# EAGLE board FranKinksTides-v1.4 (EAGLE 7.2.0), part 1 of 2
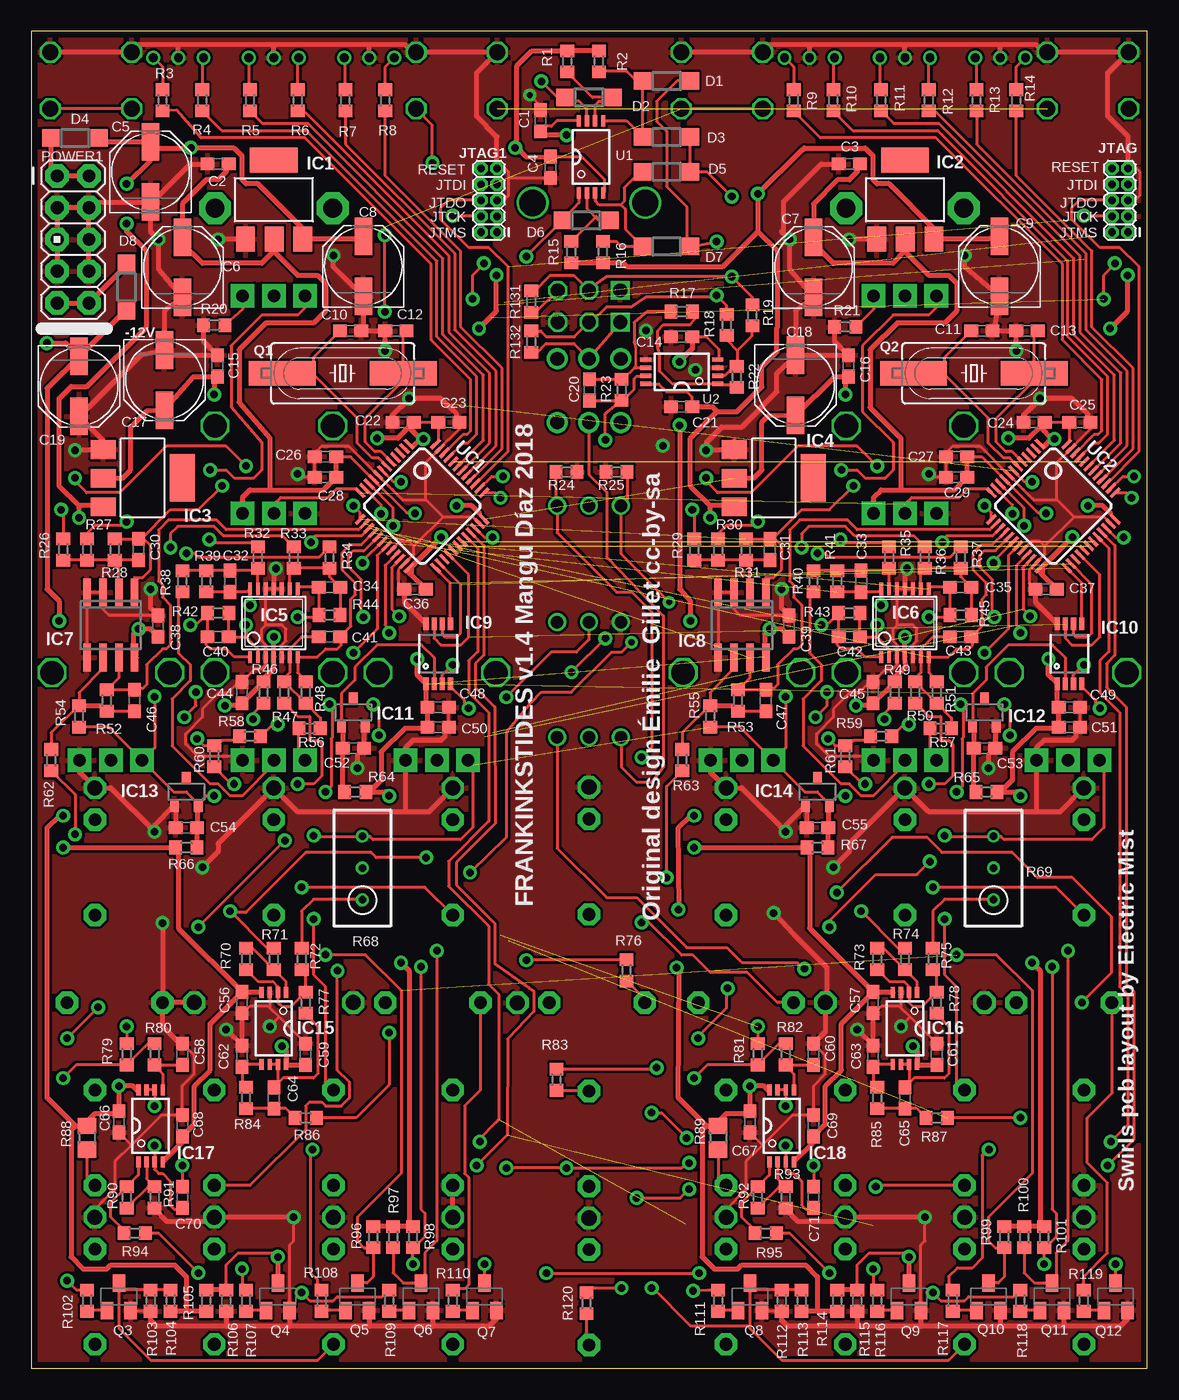
[diagram p7: board, top side]
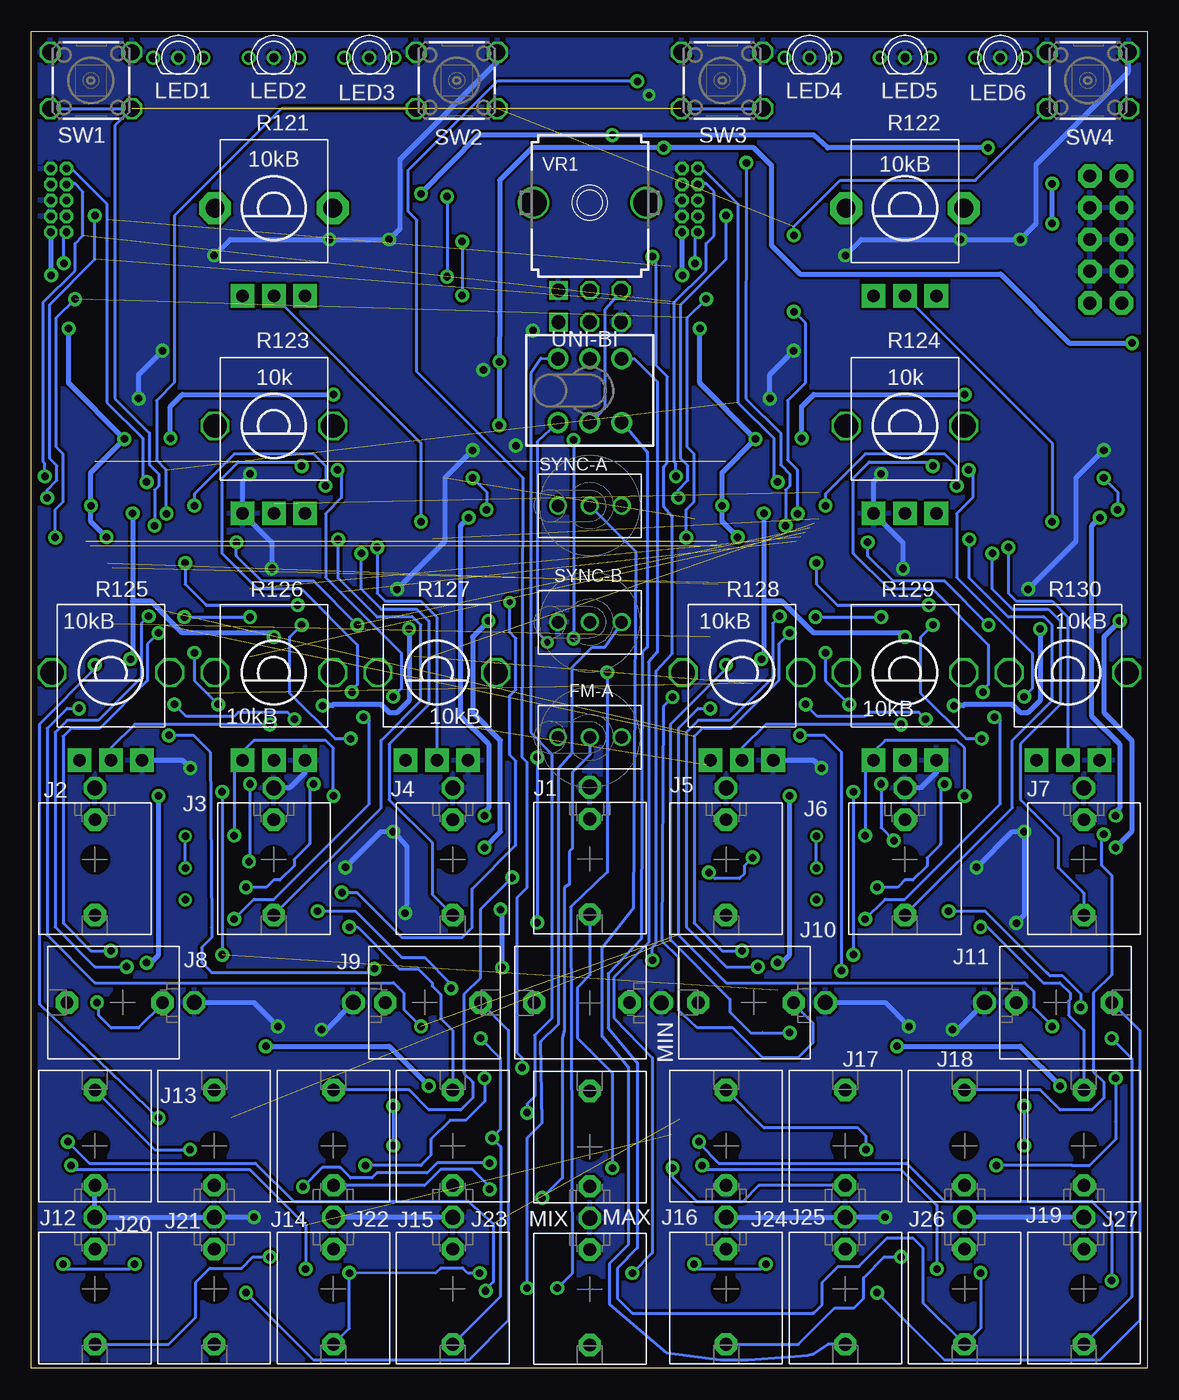
[diagram p8: board, bottom side, seen from below]

Size 89.14 x 106.8 mm. Coordinates in mm from the lower left corner, seen from the top.
Outline: 0,0 89.14,0 89.14,106.8 0,106.8 0,0
Copper layers (1*16): Top 0.035mm / dielectric 1.5mm / Bottom 0.035mm
Design rules "PCBCart-Standard *": minimum track width 10mil, minimum drill 0.4mm, track to track 8mil, track to pad 8mil, pad to pad 8mil, via to via 8mil, smd to smd 8mil, copper to edge 20mil, drill to drill 8mil, minimum pad ring 8mil, minimum via ring 10mil, stop-mask expansion 3mil, vias tented up to drill 25mil, thermal gap 8mil
bRestrict: area 3.9,5.1 to 6.3,7.5; area 13.4,5.1 to 15.8,7.5; area 22.9,5.1 to 25.3,7.5; area 32.5,5.1 to 34.9,7.5; area 43.3,5.1 to 45.7,7.5; area 54.3,5.1 to 56.7,7.5; area 63.8,5.1 to 66.2,7.5; area 73.3,5.1 to 75.7,7.5; area 82.8,5.1 to 85.2,7.5; area 82.8,16.6 to 85.2,19; area 73.3,16.6 to 75.7,18.9; area 63.8,16.6 to 66.2,18.9; 18 more areas

## Footprints (pad centres in the part's own frame; a part is rotated, then mirrored left to right if it is on the bottom)
C0603 = smd 1.1 x 1: 1 -0.85,0; 2 0.85,0
PANASONIC_D = smd 3 x 1.4: + 2.4,0; - -2.4,0
SOD123 = smd 1.4 x 1.4: A 1.9,0; C -1.9,0
SUBMINI_TOGGLE = drill 1 pad 1.422: 1 -2.54,0; 3 2.54,0; COM 0,0
SOT223 = smd 1.499 x 2.007: 1 -2.261,-3.15; 2 0.025,-3.15; 3 2.311,-3.15 | smd 3.81 x 2.007: 4 0,3.15
TSSOP14 = smd 0.305 x 0.991: 1 -1.905,-2.718; 2 -1.27,-2.718; 3 -0.635,-2.718; 4 0,-2.718; 5 0.635,-2.718; 6 1.27,-2.718; 7 1.905,-2.718; 8 1.905,2.718; 9 1.27,2.718; 10 0.635,2.718; 11 0,2.718; 12 -0.635,2.718; 13 -1.27,2.718; 14 -1.905,2.718
SO08 = smd 0.6 x 2.2: 1 -1.905,-2.6; 2 -0.635,-2.6; 3 0.635,-2.6; 4 1.905,-2.6; 5 1.905,2.6; 6 0.635,2.6; 7 -0.635,2.6; 8 -1.905,2.6
MSOP-8 = smd 0.41 x 1.02: 1 -0.975,-2.4; 2 -0.325,-2.4; 3 0.325,-2.4; 4 0.975,-2.4; 5 0.975,2.4; 6 0.325,2.4; 7 -0.325,2.4; 8 -0.975,2.4
DBZ_R-PDSO-G3 = smd 0.7 x 1: 1 -0.95,-1.1; 2 0.95,-1.1; 3 0,1.1
TSSOP-8 = smd 0.9 x 0.35: 1 -2.875,0.975; 2 -2.875,0.325; 3 -2.875,-0.325; 4 -2.875,-0.975; 5 2.875,-0.975; 6 2.875,-0.325; 7 2.875,0.325; 8 2.875,0.975
OG-PJ301_VARIATIONS_WQP_PJ_301M6 = drill 1.2 pad 1.778 octagon: P1 0,-5.715 | drill 1.016 pad 1.778 octagon: P2 0,-3.175; P3 0,4.445
2X5-1.27 = drill 0.61 pad 1.067 octagon: 1 -1.27,3.81; 2 0,3.81; 3 -1.27,2.54; 4 0,2.54; 5 -1.27,1.27; 6 0,1.27; 7 -1.27,0; 8 0,0; 9 -1.27,-1.27; 10 0,-1.27
LED-BICOLOR-THROUGHHOLE = drill 0.7: 1 -2,0; 2 0,0; 3 2,0
AVR_ICSP = drill 1.016 pad 1.88 octagon: 1 -1.27,5.08; 2 1.27,5.08; 3 -1.27,2.54; 4 1.27,2.54; 5 -1.27,0; 6 1.27,0; 7 -1.27,-2.54; 8 1.27,-2.54; 9 -1.27,-5.08; 10 1.27,-5.08
HC49UP = smd 5.334 x 1.93: 1 -4.826,0; 2 4.826,0
SOT23-BEC = smd 1 x 1.4: B -0.95,-1.1; C 0,1.1; E 0.95,-1.1
R0603 = smd 1 x 1.1: 1 -0.85,0; 2 0.85,0
RTRIM3296W = drill 0.61: 1 0,-2.54; 2 0,0; 3 0,2.54
R0805 = smd 1.3 x 1.5: 1 -0.95,0; 2 0.95,0
ALPS_POT_VERTICAL_PS = drill 1 pad 1.88 square: P$1 -2.5,7; P$2 0,7; P$3 2.5,7 | drill 1.5 pad 2.54 octagon: P$4 -4.7,0; P$5 4.7,0
TALLTRIMMER = drill 1 pad 1.88 square: P$1 -2.5,7; P$2 0,7; P$3 2.5,7 | drill 1.9 pad 2.1 octagon: P$4 -4.7,0; P$5 4.7,0
TL1100X = drill 1.27 octagon: 1 -3.251,-2.261; 2 3.251,-2.261; 3 -3.251,2.261; 4 3.251,2.261
LQFP48 = smd 0.254 x 1: 1 -2.75,-4.25; 2 -2.25,-4.25; 3 -1.75,-4.25; 4 -1.25,-4.25; 5 -0.75,-4.25; 6 -0.25,-4.25; 7 0.25,-4.25; 8 0.75,-4.25; 9 1.25,-4.25; 10 1.75,-4.25; 11 2.25,-4.25; 12 2.75,-4.25; 25 2.75,4.25; 26 2.25,4.25; 27 1.75,4.25; 28 1.25,4.25; 29 0.75,4.25; 30 0.25,4.25; 31 -0.25,4.25; 32 -0.75,4.25; 33 -1.25,4.25; 34 -1.75,4.25; 35 -2.25,4.25; 36 -2.75,4.25 | smd 1 x 0.254: 13 4.25,-2.75; 14 4.25,-2.25; 15 4.25,-1.75; 16 4.25,-1.25; 17 4.25,-0.75; 18 4.25,-0.25; 19 4.25,0.25; 20 4.25,0.75; 21 4.25,1.25; 22 4.25,1.75; 23 4.25,2.25; 24 4.25,2.75; 37 -4.25,2.75; 38 -4.25,2.25; 39 -4.25,1.75; 40 -4.25,1.25; 41 -4.25,0.75; 42 -4.25,0.25; 43 -4.25,-0.25; 44 -4.25,-0.75; 45 -4.25,-1.25; 46 -4.25,-1.75; 47 -4.25,-2.25; 48 -4.25,-2.75
TL4XPO = drill 1.1 pad 1.676: 1 -2.54,2.54; 2 0,2.54; 3 2.54,2.54; 4 -2.54,-2.54; 5 0,-2.54; 6 2.54,-2.54
DUAL_9MM_SNAP-IN_POT = drill 1.1 square: 1 -2.5,-7; 1B -2.5,-9.54 | drill 1.1 octagon: 2 0,-7; 2B 0,-9.54; 3 2.5,-7; 3B 2.5,-9.54 | drill 2.1 pad 2.54: CHASSIS1 -4.5,0; CHASSIS2 4.5,0

## Placement (x,y rotation side)
C1  100n  [C0603]  40.67,99.64 90 top
C2  100n  [C0603]  14.92,96.2 180 top
C3  100n  [C0603]  65.32,96.2 180 top
C4  100n  [C0603]  41.47,95.93 90 top
C5  47u  [PANASONIC_D]  9.52,95.57 90 top
C6  22u  [PANASONIC_D]  12.06,87.95 90 top
C7  22u  [PANASONIC_D]  62.47,87.95 90 top
C8  22u  [PANASONIC_D]  26.51,88.03 90 top
C9  22u  [PANASONIC_D]  77.31,88.03 90 top
C10  18p  [C0603]  25.5,82.87 180 top
C11  18p  [C0603]  75.9,82.87 180 top
C12  18p  [C0603]  29.11,82.85 0 top
C13  18p  [C0603]  79.51,82.85 0 top
C14  100n  [C0603]  51.94,82.4 0 top
C15  100n  [C0603]  14.86,80.06 90 top
C16  100n  [C0603]  65.26,80.06 90 top
C17  22u  [PANASONIC_D]  10.64,78.93 270 top
C18  22u  [PANASONIC_D]  61.04,78.53 270 top
C19  47u  [PANASONIC_D]  3.81,78.42 270 top
C20  10p  [C0603]  44.59,78.15 90 top
C21  100n  [C0603]  51.94,76.8 180 top
C22  100n  [C0603]  29.69,75.56 180 top
C23  100n  [C0603]  33.34,75.56 0 top
C24  100n  [C0603]  80.09,75.56 180 top
C25  100n  [C0603]  83.74,75.56 0 top
C26  100n  [C0603]  23.5,72.82 180 top
C27  100n  [C0603]  73.89,72.82 180 top
C28  3.3u  [C0603]  23.5,71.18 180 top
C29  3.3u  [C0603]  73.89,71.18 180 top
C30  1n  [C0603]  8.57,65.41 90 top
C31  1n  [C0603]  58.97,65.41 90 top
C32  10n  [C0603]  15.88,62.87 270 top
C33  10n  [C0603]  66.28,62.87 270 top
C34  10n  [C0603]  23.81,62.39 180 top
C35  10n  [C0603]  74.21,62.39 180 top
C36  100n  [C0603]  30.64,62.23 180 top
C37  100n  [C0603]  81.04,62.23 180 top
C38  100n  [C0603]  10.12,59.28 90 top
C39  100n  [C0603]  60.52,59.28 90 top
C40  10n  [C0603]  14.92,58.42 180 top
C41  1n  [C0603]  23.81,58.42 0 top
C42  10n  [C0603]  65.32,58.42 180 top
C43  1n  [C0603]  74.21,58.42 0 top
C44  100n  [C0603]  16.83,53.98 90 top
C45  100n  [C0603]  67.23,53.98 90 top
C46  1n  [C0603]  8.25,53.34 90 top
C47  1n  [C0603]  58.66,53.34 90 top
C48  100n  [C0603]  32.5,52.78 0 top
C49  100n  [C0603]  82.9,52.78 0 top
C50  3.3u  [C0603]  32.5,51.2 0 top
C51  3.3u  [C0603]  82.9,51.2 0 top
C52  470n  [C0603]  25.72,49.53 0 top
C53  470n  [C0603]  76.12,49.53 0 top
C54  470n  [C0603]  12.38,43.18 180 top
C55  470n  [C0603]  62.78,43.18 180 top
C56  100n  [C0603]  16.83,29.21 90 top
C57  100n  [C0603]  67.23,29.21 90 top
C58  220p  [C0603]  12.06,25.08 90 top
C59  100n  [C0603]  21.91,25.08 90 top
C60  220p  [C0603]  62.47,25.08 90 top
C61  100n  [C0603]  72.31,25.08 90 top
C62  220p  [C0603]  16.83,24.93 90 top
C63  220p  [C0603]  67.23,24.93 90 top
C64  220p  [C0603]  19.37,21.59 90 top
C65  220p  [C0603]  69.77,21.59 90 top
C66  100n  [C0603]  6.99,19.68 270 top
C67  100n  [C0603]  57.38,19.68 270 top
C68  100n  [C0603]  12.06,19.37 270 top
C69  100n  [C0603]  62.47,19.37 270 top
C70  220p  [C0603]  12.06,13.65 270 top
C71  220p  [C0603]  62.47,13.65 270 top
D1  1N4148  [SOD123]  50.73,102.83 0 top
D2  1N4148  [SOD123]  44.54,101.53 180 top
D3  1N4148  [SOD123]  50.73,98.36 0 top
D4  1N5819HW  [SOD123]  3.49,98.27 180 top
D5  1N4148  [SOD123]  50.73,95.58 180 top
D6  1N4148  [SOD123]  44.3,91.69 0 top
D7  1N4148  [SOD123]  50.73,89.61 180 top
D8  1N5819HW  [SOD123]  7.62,86.36 270 top
FM-A  SUBMINI_SPDT  [SUBMINI_TOGGLE]  44.53,50.4 0 bottom
IC1  LM1117-3.3  [SOT223]  19.37,93.34 0 top
IC2  LM1117-3.3  [SOT223]  69.77,93.34 0 top
IC3  LM1117-3.3  [SOT223]  8.89,71.12 270 top
IC4  LM1117-3.3  [SOT223]  59.29,71.12 270 top
IC5  MCP6004  [TSSOP14]  19.37,59.53 0 top
IC6  MCP6004  [TSSOP14]  69.77,59.53 0 top
IC7  MCP6002  [SO08]  6.35,59.37 180 top
IC8  MCP6002  [SO08]  56.75,59.37 180 top
IC9  DAC8552  [MSOP-8]  32.5,57.07 0 top
IC10  DAC8552  [MSOP-8]  82.9,57.07 0 top
IC11  LM4040B25  [DBZ_R-PDSO-G3]  25.72,52.39 0 top
IC12  LM4040B25  [DBZ_R-PDSO-G3]  76.12,52.39 0 top
IC13  LM4040B10  [DBZ_R-PDSO-G3]  12.38,46.04 0 top
IC14  LM4040B10  [DBZ_R-PDSO-G3]  62.78,46.04 0 top
IC15  TL072  [TSSOP-8]  19.37,27.14 270 top
IC16  TL072  [TSSOP-8]  69.77,27.14 270 top
IC17  TL072  [TSSOP-8]  9.52,19.37 90 top
IC18  TL072  [TSSOP-8]  59.92,19.37 90 top
J1  PJ301_GUI6  [OG-PJ301_VARIATIONS_WQP_PJ_301M6]  44.53,40.7 180 bottom
J2  PJ301_GUI6  [OG-PJ301_VARIATIONS_WQP_PJ_301M6]  84.05,40.64 180 bottom
J3  PJ301_GUI6  [OG-PJ301_VARIATIONS_WQP_PJ_301M6]  69.77,40.64 180 bottom
J4  PJ301_GUI6  [OG-PJ301_VARIATIONS_WQP_PJ_301M6]  55.48,40.64 180 bottom
J5  PJ301_GUI6  [OG-PJ301_VARIATIONS_WQP_PJ_301M6]  33.66,40.64 180 bottom
J6  PJ301_GUI6  [OG-PJ301_VARIATIONS_WQP_PJ_301M6]  19.37,40.64 180 bottom
J7  PJ301_GUI6  [OG-PJ301_VARIATIONS_WQP_PJ_301M6]  5.08,40.64 180 bottom
J8  PJ301_GUI6  [OG-PJ301_VARIATIONS_WQP_PJ_301M6]  81.83,29.21 90 bottom
J9  PJ301_GUI6  [OG-PJ301_VARIATIONS_WQP_PJ_301M6]  57.7,29.21 270 bottom
J10  PJ301_GUI6  [OG-PJ301_VARIATIONS_WQP_PJ_301M6]  31.43,29.21 90 bottom
J11  PJ301_GUI6  [OG-PJ301_VARIATIONS_WQP_PJ_301M6]  7.3,29.21 270 bottom
J12  PJ301_GUI6  [OG-PJ301_VARIATIONS_WQP_PJ_301M6]  84.05,17.78 0 bottom
J13  PJ301_GUI6  [OG-PJ301_VARIATIONS_WQP_PJ_301M6]  74.53,17.78 0 bottom
J14  PJ301_GUI6  [OG-PJ301_VARIATIONS_WQP_PJ_301M6]  65,17.78 0 bottom
J15  PJ301_GUI6  [OG-PJ301_VARIATIONS_WQP_PJ_301M6]  55.48,17.78 0 bottom
J16  PJ301_GUI6  [OG-PJ301_VARIATIONS_WQP_PJ_301M6]  33.66,17.78 0 bottom
J17  PJ301_GUI6  [OG-PJ301_VARIATIONS_WQP_PJ_301M6]  24.13,17.78 0 bottom
J18  PJ301_GUI6  [OG-PJ301_VARIATIONS_WQP_PJ_301M6]  14.61,17.78 0 bottom
J19  PJ301_GUI6  [OG-PJ301_VARIATIONS_WQP_PJ_301M6]  5.08,17.78 0 bottom
J20  PJ301_GUI6  [OG-PJ301_VARIATIONS_WQP_PJ_301M6]  84.05,6.35 180 bottom
J21  PJ301_GUI6  [OG-PJ301_VARIATIONS_WQP_PJ_301M6]  74.53,6.35 180 bottom
J22  PJ301_GUI6  [OG-PJ301_VARIATIONS_WQP_PJ_301M6]  65,6.35 180 bottom
J23  PJ301_GUI6  [OG-PJ301_VARIATIONS_WQP_PJ_301M6]  55.48,6.35 180 bottom
J24  PJ301_GUI6  [OG-PJ301_VARIATIONS_WQP_PJ_301M6]  33.66,6.35 180 bottom
J25  PJ301_GUI6  [OG-PJ301_VARIATIONS_WQP_PJ_301M6]  24.13,6.35 180 bottom
J26  PJ301_GUI6  [OG-PJ301_VARIATIONS_WQP_PJ_301M6]  14.61,6.35 180 bottom
J27  PJ301_GUI6  [OG-PJ301_VARIATIONS_WQP_PJ_301M6]  5.08,6.35 180 bottom
JTAG  M05X2MINIJTAG  [2X5-1.27]  86.31,94.56 180 top
JTAG1  M05X2MINIJTAG  [2X5-1.27]  35.91,94.56 180 top
LED1  WP115VEGW  [LED-BICOLOR-THROUGHHOLE]  77.39,104.68 0 bottom
LED2  WP115VEGW  [LED-BICOLOR-THROUGHHOLE]  69.77,104.68 0 bottom
LED3  WP115VEGW  [LED-BICOLOR-THROUGHHOLE]  62.15,104.68 0 bottom
LED4  WP115VEGW  [LED-BICOLOR-THROUGHHOLE]  26.99,104.68 0 bottom
LED5  WP115VEGW  [LED-BICOLOR-THROUGHHOLE]  19.37,104.68 0 bottom
LED6  WP115VEGW  [LED-BICOLOR-THROUGHHOLE]  11.75,104.68 0 bottom
MAX  PJ301_GUI6  [OG-PJ301_VARIATIONS_WQP_PJ_301M6]  44.53,17.7 0 bottom
MIN  PJ301_GUI6  [OG-PJ301_VARIATIONS_WQP_PJ_301M6]  44.53,29.2 90 bottom
MIX  PJ301_GUI6  [OG-PJ301_VARIATIONS_WQP_PJ_301M6]  44.53,6.3 180 bottom
POWER1  M05X2PTH  [AVR_ICSP]  3.33,90.17 0 top
Q1  8MHz  [HC49UP]  24.87,79.48 0 top
Q2  8MHz  [HC49UP]  75.27,79.48 0 top
Q3  MMBT3904  [SOT23-BEC]  6.99,5.71 0 top
Q4  MMBT3904  [SOT23-BEC]  19.68,5.71 0 top
Q5  MMBT3904  [SOT23-BEC]  26.04,5.71 0 top
Q6  MMBT3904  [SOT23-BEC]  31.12,5.71 0 top
Q7  MMBT3904  [SOT23-BEC]  36.2,5.71 0 top
Q8  MMBT3904  [SOT23-BEC]  57.38,5.71 0 top
Q9  MMBT3904  [SOT23-BEC]  70.08,5.71 0 top
Q10  MMBT3904  [SOT23-BEC]  76.44,5.71 0 top
Q11  MMBT3904  [SOT23-BEC]  81.52,5.71 0 top
Q12  MMBT3904  [SOT23-BEC]  86.59,5.71 0 top
R1  220k  [R0603]  42.79,104.39 90 top
R2  220k  [R0603]  45.33,104.39 90 top
R3  100  [R0603]  10.48,101.28 90 top
R4  100  [R0603]  13.65,101.28 90 top
R5  100  [R0603]  17.46,101.28 90 top
R6  100  [R0603]  21.27,101.28 90 top
R7  100  [R0603]  25.08,101.28 90 top
R8  100  [R0603]  28.26,101.28 90 top
R9  100  [R0603]  60.88,101.28 90 top
R10  100  [R0603]  64.05,101.28 90 top
R11  100  [R0603]  67.86,101.28 90 top
R12  100  [R0603]  71.67,101.28 90 top
R13  100  [R0603]  75.48,101.28 90 top
R14  100  [R0603]  78.66,101.28 90 top
R15  220k  [R0603]  43.11,89.15 270 top
R16  220k  [R0603]  45.65,89.15 270 top
R17  100k  [R0603]  51.94,84.4 0 top
R18  100k  [R0603]  55.53,83.35 90 top
R19  100k  [R0603]  57.59,84.1 90 top
R20  2.49k  [R0603]  14.61,83.31 0 top
R21  2.49k  [R0603]  65,83.19 0 top
R22  100k  [R0603]  56.34,79.2 90 top
R23  100k  [R0603]  47.13,78.15 90 top
R24  100k  [R0603]  42.73,71.6 180 top
R25  100k  [R0603]  46.73,71.6 180 top
R26  100k  [R0603]  2.54,65.41 90 top
R27  100k  [R0603]  4.45,65.41 90 top
R28  27k  [R0603]  6.67,65.41 270 top
R29  100k  [R0603]  52.94,65.41 90 top
R30  100k  [R0603]  54.84,65.41 90 top
R31  27k  [R0603]  57.07,65.41 270 top
R32  100k  [R0603]  18.1,64.77 90 top
R33  100k  [R0603]  20.95,64.77 90 top
R34  100k  [R0603]  23.81,64.77 90 top
R35  100k  [R0603]  68.5,64.77 90 top
R36  100k  [R0603]  71.36,64.77 90 top
R37  100k  [R0603]  74.21,64.77 90 top
R38  100k  [R0603]  12.06,62.87 270 top
R39  33k  [R0603]  13.97,62.87 90 top
R40  100k  [R0603]  62.47,62.87 270 top
R41  33k  [R0603]  64.37,62.87 90 top
R42  33k  [R0603]  14.92,60.33 0 top
R43  33k  [R0603]  65.32,60.33 0 top
R44  33k  [R0603]  23.81,60.16 0 top
R45  33k  [R0603]  74.21,60.16 0 top
R46  3.3M  [R0603]  18.54,53.98 90 top
R47  100k  [R0603]  20.19,53.98 270 top
R48  39k  [R0603]  21.91,53.98 270 top
R49  3.3M  [R0603]  68.94,53.98 90 top
R50  100k  [R0603]  70.59,53.98 270 top
R51  39k  [R0603]  72.31,53.98 270 top
R52  20k  [R0603]  6.03,53.34 270 top
R53  20k  [R0603]  56.43,53.34 270 top
R54  120k  [R0603]  3.81,52.07 270 top
R55  120k  [R0603]  54.21,52.07 270 top
R56  120k  [R0603]  22.22,51.12 180 top
R57  120k  [R0603]  72.62,51.12 180 top
R58  100k  [R0603]  17.46,50.48 0 top
R59  100k  [R0603]  67.86,50.48 0 top
R60  100k  [R0603]  14.61,48.9 270 top
R61  100k  [R0603]  65,48.9 270 top
R62  100k  [R0603]  1.59,48.58 270 top
R63  100k  [R0603]  51.99,48.58 270 top
R64  3.3k  [R0603]  25.88,46.04 180 top
R65  3.3k  [R0603]  76.28,46.04 180 top
R66  270  [R0603]  12.38,41.59 0 top
R67  270  [R0603]  62.78,41.59 0 top
R68  50k  [RTRIM3296W]  26.43,39.96 0 top
R69  50k  [RTRIM3296W]  76.83,39.96 0 top
R70  120k  [R0603]  17.14,32.7 270 top
R71  100  [R0603]  19.37,32.7 270 top
R72  220k  [R0603]  21.59,32.7 90 top
R73  120k  [R0603]  67.55,32.7 270 top
R74  100  [R0603]  69.77,32.7 270 top
R75  220k  [R0603]  71.99,32.7 90 top
R76  180  [R0603]  47.53,31.79 90 top
R77  30k  [R0603]  21.91,29.21 270 top
R78  30k  [R0603]  72.31,29.21 270 top
R79  100k  [R0603]  7.62,25.08 90 top
R80  100k  [R0603]  9.84,25.08 90 top
R81  100k  [R0603]  58.02,25.08 90 top
R82  100k  [R0603]  60.24,25.08 90 top
R83  180  [R0603]  41.94,23.05 90 top
R84  33k  [R0603]  17.14,21.59 270 top
R85  33k  [R0603]  67.55,21.59 270 top
R86  33k  [R0603]  21.91,20 0 top
R87  33k  [R0603]  72.31,20 0 top
R88  2.49k  [R0805]  4.45,18.41 270 top
R89  2.49k  [R0805]  54.84,18.41 270 top
R90  220k  [R0603]  7.62,13.65 270 top
R91  100k  [R0603]  9.84,13.65 90 top
R92  220k  [R0603]  58.02,13.65 270 top
R93  100k  [R0603]  60.24,13.65 90 top
R94  100  [R0603]  8.25,10.79 180 top
R95  100  [R0603]  58.66,10.79 180 top
R96  10k  [R0603]  27.3,10.48 90 top
R97  10k  [R0603]  28.89,10.48 90 top
R98  10k  [R0603]  30.48,10.48 90 top
R99  10k  [R0603]  77.7,10.48 90 top
R100  10k  [R0603]  79.29,10.48 90 top
R101  10k  [R0603]  80.88,10.48 90 top
R102  10k  [R0603]  4.45,5.4 270 top
R103  3.3k  [R0603]  9.52,5.4 90 top
R104  4.7k  [R0603]  11.11,5.4 270 top
R105  4.7k  [R0603]  13.97,5.4 270 top
R106  3.3k  [R0603]  15.56,5.4 90 top
R107  10k  [R0603]  17.14,5.4 270 top
R108  100k  [R0603]  23.18,5.4 270 top
R109  100k  [R0603]  28.58,5.4 270 top
R110  100k  [R0603]  33.66,5.4 270 top
R111  10k  [R0603]  54.84,5.4 270 top
R112  3.3k  [R0603]  59.92,5.4 90 top
R113  4.7k  [R0603]  61.51,5.4 270 top
R114  4.7k  [R0603]  64.37,5.4 270 top
R115  3.3k  [R0603]  65.96,5.4 90 top
R116  10k  [R0603]  67.55,5.4 270 top
R117  100k  [R0603]  73.58,5.4 270 top
R118  100k  [R0603]  78.97,5.4 270 top
R119  100k  [R0603]  84.05,5.4 270 top
R120  51  [R0603]  44.34,5.2 90 top
R121  10kB  [ALPS_POT_VERTICAL_PS]  69.77,92.66 180 bottom
R122  10kB  [ALPS_POT_VERTICAL_PS]  19.37,92.66 180 bottom
R123  10k  [TALLTRIMMER]  69.77,75.28 180 bottom
R124  10k  [TALLTRIMMER]  19.37,75.28 180 bottom
R125  10kB  [TALLTRIMMER]  82.78,55.56 180 bottom
R126  10kB  [TALLTRIMMER]  69.77,55.56 180 bottom
R127  10kB  [TALLTRIMMER]  56.75,55.56 180 bottom
R128  10kB  [TALLTRIMMER]  32.38,55.56 180 bottom
R129  10kB  [TALLTRIMMER]  19.37,55.56 180 bottom
R130  10kB  [TALLTRIMMER]  6.35,55.56 180 bottom
R131  log res  [R0603]  39.94,85.2 90 top
R132  log res  [R0603]  39.94,82 90 top
SW1  TL1100X  [TL1100X]  84.37,102.87 180 bottom
SW2  TL1100X  [TL1100X]  55.16,102.87 180 bottom
SW3  TL1100X  [TL1100X]  33.97,102.87 180 bottom
SW4  TL1100X  [TL1100X]  4.76,102.87 180 bottom
SYNC-A  SUBMINI_SPDT  [SUBMINI_TOGGLE]  44.53,68.9 0 bottom
SYNC-B  SUBMINI_SPDT  [SUBMINI_TOGGLE]  44.53,59.6 0 bottom
U1  TL072TSSOP  [TSSOP-8]  44.7,96.77 90 top
U2  TL072TSSOP  [TSSOP-8]  51.94,79.6 180 top
UC1  STM32F103CBT6  [LQFP48]  31.21,68.88 225 top
UC2  STM32F103CBT6  [LQFP48]  81.61,68.88 225 top
UNI-BI  TL49PO  [TL4XPO]  44.53,78.1 0 bottom
VR1  [DUAL_9MM_SNAP-IN_POT]  44.53,93.1 0 bottom